# Altium schematic sheet ICEBoard_rev1.1.SchDoc
size A
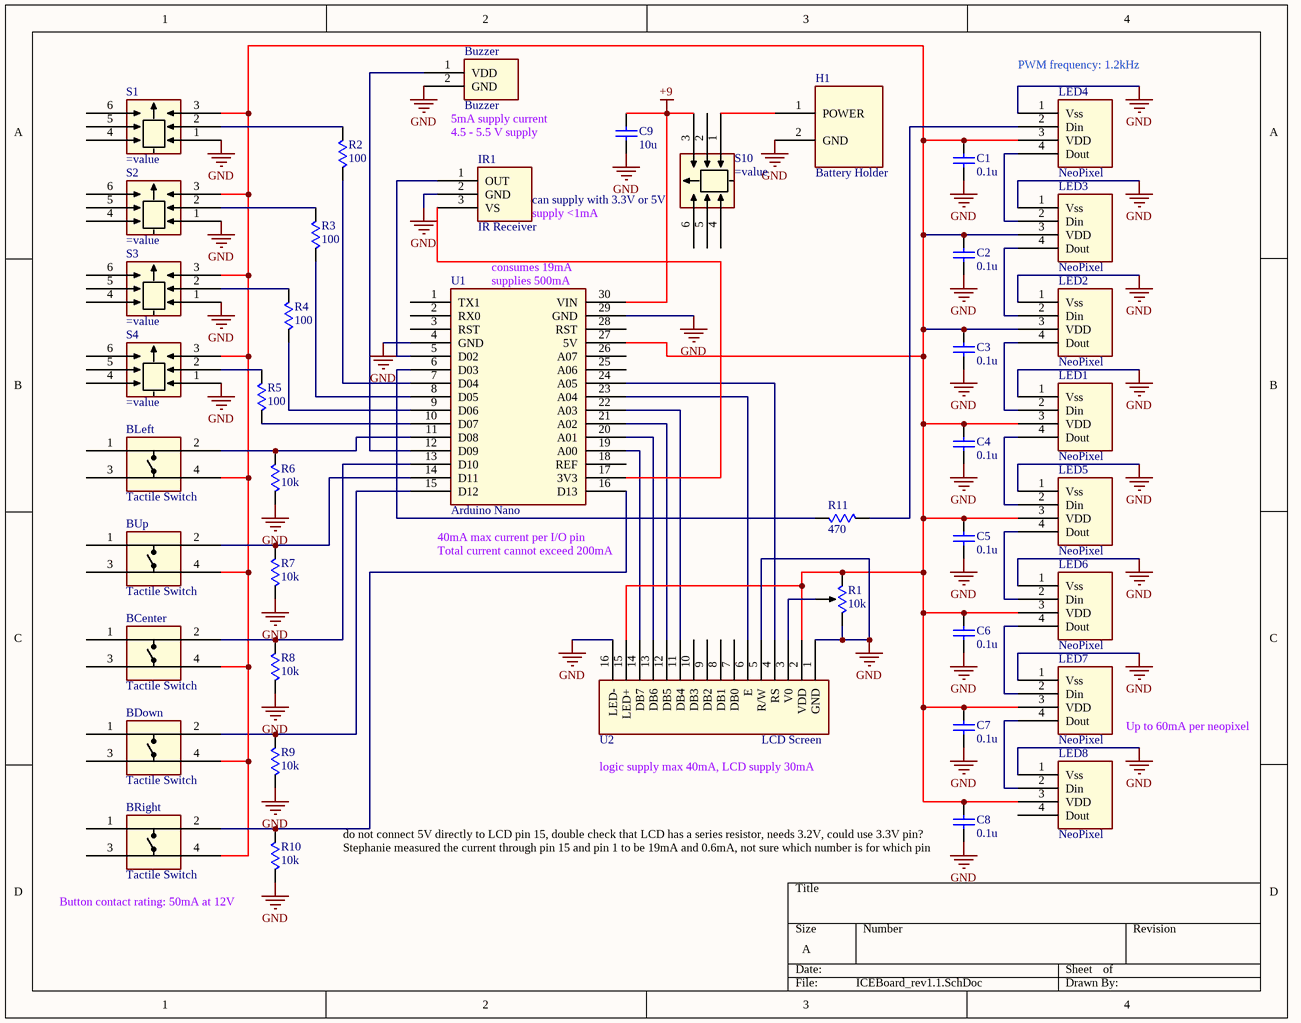
[diagram p0: ICEBoard_rev1.1.SchDoc]

## Parts
BCenter  Tactile Switch  [PTS645]
BDown  Tactile Switch  [PTS645]
BLeft  Tactile Switch  [PTS645]
BRight  Tactile Switch  [PTS645]
BUp  Tactile Switch  [PTS645]
Buzzer  Buzzer  [TP124005]
C1  0.1u  [Capacitor]
C2  0.1u  [Capacitor]
C3  0.1u  [Capacitor]
C4  0.1u  [Capacitor]
C5  0.1u  [Capacitor]
C6  0.1u  [Capacitor]
C7  0.1u  [Capacitor]
C8  0.1u  [Capacitor]
C9  10u  [PCBComponent_1]
H1  Battery Holder  [BH9VPC]
IR1  IR Receiver  [TSOP382]
LED1  NeoPixel  [NeoPixel]
LED2  NeoPixel  [NeoPixel]
LED3  NeoPixel  [NeoPixel]
LED4  NeoPixel  [NeoPixel]
LED5  NeoPixel  [NeoPixel]
LED6  NeoPixel  [NeoPixel]
LED7  NeoPixel  [NeoPixel]
LED8  NeoPixel  [NeoPixel]
R1  10k  [TC33X]
R2  100  [Resistor1608]
R3  100  [Resistor1608]
R4  100  [Resistor1608]
R5  100  [Resistor1608]
R6  10k  [Resistor1608]
R7  10k  [Resistor1608]
R8  10k  [Resistor1608]
R9  10k  [Resistor1608]
R10  10k  [Resistor1608]
R11  470  [Resistor1608]
S1  (no value)  [MHSS1104]
S2  (no value)  [MHSS1104]
S3  (no value)  [MHSS1104]
S4  (no value)  [MHSS1104]
S10  (no value)  [MHSS1104]
U1  Arduino Nano  [ArduinoNano]
U2  LCD Screen  [TC1602A-01T]

## Nets
+9: C9.1 S10.3 U1.30(VIN)
GND: Buzzer.2(GND) C1.2 C2.2 C3.2 C4.2 C5.2 C6.2 C7.2 C8.2 C9.2 H1.2(GND) IR1.2(GND) LED1.1(Vss) LED2.1(Vss) LED3.1(Vss) LED4.1(Vss) LED5.1(Vss) LED6.1(Vss) LED7.1(Vss) LED8.1(Vss) R1.1 R6.1 R7.1 R8.1 R9.1 R10.1 S1.1 S2.1 S3.1 S4.1 U1.4(GND) U1.29(GND) U2.1(GND) U2.5(R/W) U2.16(LED-)
NetBCenter_2: BCenter.2 R8.2 U1.13(D10)
NetBCenter_4: BCenter.4 BDown.4 BLeft.4 BRight.4 BUp.4 C1.1 C2.1 C3.1 C4.1 C5.1 C6.1 C7.1 C8.1 LED1.3(VDD) LED2.3(VDD) LED3.3(VDD) LED4.3(VDD) LED5.3(VDD) LED6.3(VDD) LED7.3(VDD) LED8.3(VDD) R1.3 S1.3 S2.3 S3.3 S4.3 U1.27(5V) U2.2(VDD) U2.15(LED+)
NetBDown_2: BDown.2 R9.2 U1.15(D12)
NetBLeft_2: BLeft.2 R6.2 U1.11(D08)
NetBRight_2: BRight.2 R10.2 U1.16(D13)
NetBUp_2: BUp.2 R7.2 U1.14(D11)
NetBuzzer_1: Buzzer.1(VDD) U1.12(D09)
NetH1_1: H1.1(POWER) S10.1
NetIR1_1: IR1.1(OUT) U1.5(D02)
NetIR1_3: IR1.3(VS) U1.17(3V3)
NetLED1_2: LED1.2(Din) LED2.4(Dout)
NetLED1_4: LED1.4(Dout) LED5.2(Din)
NetLED2_2: LED2.2(Din) LED3.4(Dout)
NetLED3_2: LED3.2(Din) LED4.4(Dout)
NetLED4_2: LED4.2(Din) R11.2
NetLED5_4: LED5.4(Dout) LED6.2(Din)
NetLED6_4: LED6.4(Dout) LED7.2(Din)
NetLED7_4: LED7.4(Dout) LED8.2(Din)
NetR1_2: R1.2 U2.3(V0)
NetR2_1: R2.1 U1.7(D04)
NetR2_2: R2.2 S1.2
NetR3_1: R3.1 U1.8(D05)
NetR3_2: R3.2 S2.2
NetR4_1: R4.1 U1.9(D06)
NetR4_2: R4.2 S3.2
NetR5_1: R5.1 U1.10(D07)
NetR5_2: R5.2 S4.2
NetR11_1: R11.1 U1.6(D03)
NetU1_19: U1.19(A00) U2.14(DB7)
NetU1_20: U1.20(A01) U2.13(DB6)
NetU1_21: U1.21(A02) U2.12(DB5)
NetU1_22: U1.22(A03) U2.11(DB4)
NetU1_23: U1.23(A04) U2.6(E)
NetU1_24: U1.24(A05) U2.4(RS)

Not connected (* = marked no-connect by the designer): BCenter 1 3; BDown 1 3; BLeft 1 3; BRight 1 3; BUp 1 3; LED8 4(Dout); S1 4 5 6; S2 4 5 6; S3 4 5 6; S4 4 5 6; S10 2 4 5 6; U1 1(TX1) 2(RX0) 3(RST) 18(REF) 25(A06) 26(A07) 28(RST); U2 7(DB0) 8(DB1) 9(DB2) 10(DB3)

## Notes on the sheet
- (near LED4) PWM frequency: 1.2kHz
- (near Buzzer) 5mA supply current
- 4.5 - 5.5 V supply
- (near S10) can supply with 3.3V or 5V
- supply <1mA
- (near U1) consumes 19mA
- (near U1) supplies 500mA
- (near U1) 40mA max current per I/O pin
- Total current cannot exceed 200mA
- logic supply max 40mA, LCD supply 30mA
- Up to 60mA per neopixel
- (near C8) do not connect 5V directly to LCD pin 15, double check that LCD has a series resistor, needs 3.2V, could use 3.3V pin?
- Button contact rating: 50mA at 12V
- (near C8) Stephanie measured the current through pin 15 and pin 1 to be 19mA and 0.6mA, not sure which number is for which pin

## Library data of the parts
BCenter BDown BLeft BRight BUp = PTS645
Buzzer = TP124005
C1-C9 = Capacitor
H1 = BH9VPC
IR1 = TSOP382
R1 = Resistor - Variable
R2-R11 = Resistor
S1-S4 S10 = MHSS1104
U1 = ArduinoNano
U2 = TC1602A-01T